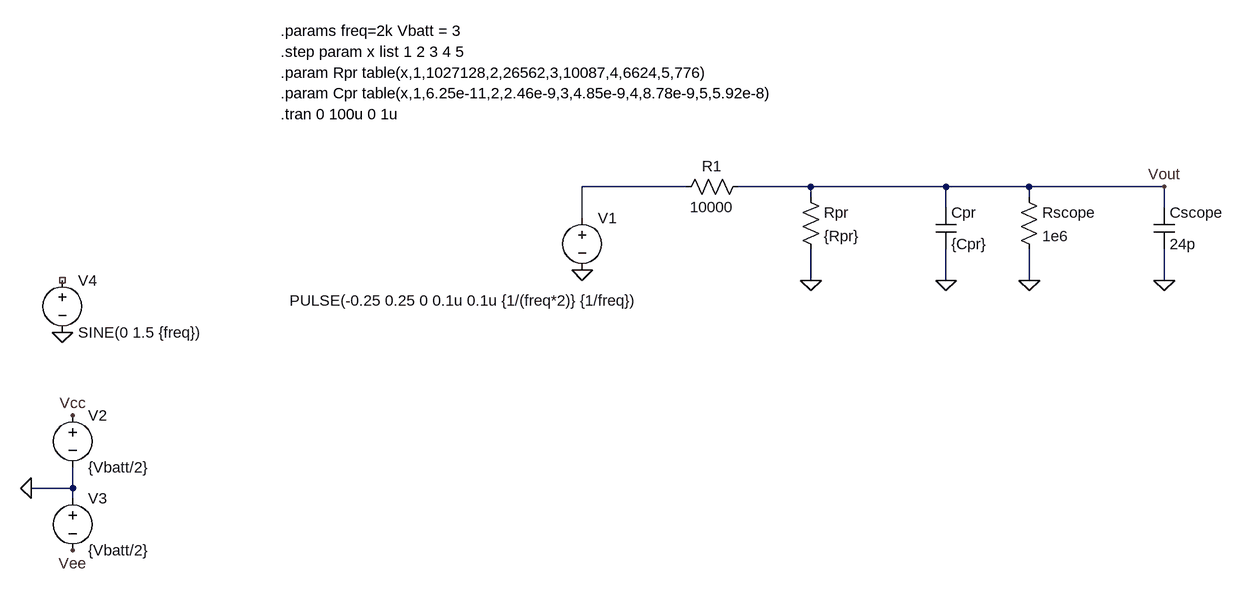
[diagram p0: schematic RprCpr.asc]
RprCpr.asc, the LTspice schematic file:
Version 4
SHEET 1 1572 680
WIRE 144 32 -16 32
WIRE 336 32 224 32
WIRE 544 32 336 32
WIRE 672 32 544 32
WIRE 880 32 672 32
WIRE 336 48 336 32
WIRE 672 48 672 32
WIRE 544 64 544 32
WIRE 880 64 880 32
WIRE -16 80 -16 32
WIRE 336 176 336 128
WIRE 544 176 544 128
WIRE 672 176 672 128
WIRE 880 176 880 128
WIRE -800 496 -800 464
WIRE -800 496 -864 496
WIRE -800 512 -800 496
FLAG 544 176 0
FLAG -16 160 0
FLAG 336 176 0
FLAG -864 496 0
FLAG -800 384 Vcc
FLAG -800 592 Vee
FLAG -816 256 0
FLAG 880 176 0
FLAG 672 176 0
FLAG 880 32 Vout
SYMBOL voltage -16 64 R0
WINDOW 3 -450 143 Left 2
WINDOW 123 24 124 Left 2
WINDOW 39 0 0 Left 0
SYMATTR Value PULSE(-0.25 0.25 0 0.1u 0.1u {1/(freq*2)} {1/freq})
SYMATTR InstName V1
SYMBOL res 240 16 R90
WINDOW 0 0 56 VBottom 2
WINDOW 3 32 56 VTop 2
SYMATTR InstName R1
SYMATTR Value 10000
SYMBOL cap 528 64 R0
SYMATTR InstName Cpr
SYMATTR Value {Cpr}
SYMBOL res 320 32 R0
SYMATTR InstName Rpr
SYMATTR Value {Rpr}
SYMBOL voltage -800 368 R0
SYMATTR InstName V2
SYMATTR Value {Vbatt/2}
SYMBOL voltage -800 496 R0
SYMATTR InstName V3
SYMATTR Value {Vbatt/2}
SYMBOL voltage -816 160 R0
WINDOW 123 0 0 Left 0
WINDOW 39 0 0 Left 0
SYMATTR InstName V4
SYMATTR Value SINE(0 1.5 {freq})
SYMBOL cap 864 64 R0
SYMATTR InstName Cscope
SYMATTR Value 24p
SYMBOL res 656 32 R0
SYMATTR InstName Rscope
SYMATTR Value 1e6
TEXT -480 -208 Left 2 !.params freq=2k Vbatt = 3
TEXT -480 -80 Left 2 !.tran 0 100u 0 1u
TEXT -480 -144 Left 2 !.param Rpr table(x,1,1027128,2,26562,3,10087,4,6624,5,776)
TEXT -480 -176 Left 2 !.step param x list 1 2 3 4 5
TEXT -480 -112 Left 2 !.param Cpr table(x,1,6.25e-11,2,2.46e-9,3,4.85e-9,4,8.78e-9,5,5.92e-8)

The netlist it stands for:
* RprCpr.asc
V1 N001 0 PULSE(-0.25 0.25 0 0.1u 0.1u {1/(freq*2)} {1/freq})
R1 Vout N001 10000
Cpr Vout 0 {Cpr}
Rpr Vout 0 {Rpr}
V2 Vcc 0 {Vbatt/2}
V3 0 Vee {Vbatt/2}
V4 NC_01 0 SINE(0 1.5 {freq})
Cscope Vout 0 24p
Rscope Vout 0 1e6
.params freq=2k Vbatt = 3
.tran 0 100u 0 1u
.param Rpr table(x,1,1027128,2,26562,3,10087,4,6624,5,776)
.step param x list 1 2 3 4 5
.param Cpr table(x,1,6.25e-11,2,2.46e-9,3,4.85e-9,4,8.78e-9,5,5.92e-8)
.backanno
.end